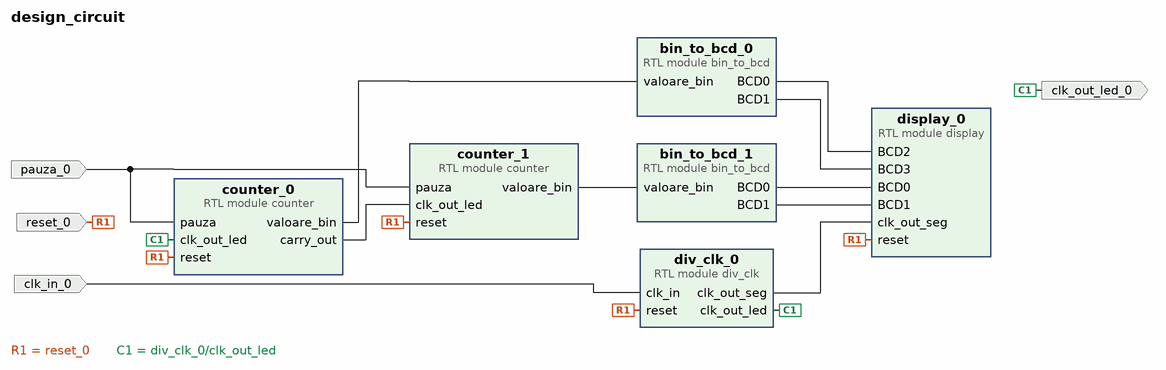
[diagram p0: block diagram of the top level]
# Vivado block design design_circuit, xc7a100tcsg324-1, Vivado 2019.2.1
create_bd_design design_circuit

create_bd_port -dir I pauza_0
create_bd_port -dir I -type rst reset_0
create_bd_port -dir I clk_in_0
create_bd_port -dir O clk_out_led_0

create_bd_cell -type module -reference counter counter_0
create_bd_cell -type module -reference counter counter_1
create_bd_cell -type module -reference bin_to_bcd bin_to_bcd_0
create_bd_cell -type module -reference bin_to_bcd bin_to_bcd_1
create_bd_cell -type module -reference display display_0
create_bd_cell -type module -reference div_clk div_clk_0

# ---- connections ----

connect_bd_net [get_bd_pins counter_0/valoare_bin] [get_bd_pins bin_to_bcd_0/valoare_bin]
connect_bd_net [get_bd_pins counter_0/carry_out] [get_bd_pins counter_1/clk_out_led]
connect_bd_net -net pauza_0_1 [get_bd_ports pauza_0] [get_bd_pins counter_0/pauza] [get_bd_pins counter_1/pauza]
connect_bd_net -net reset_0_1 [get_bd_ports reset_0] \
  [get_bd_pins counter_0/reset] [get_bd_pins display_0/reset] [get_bd_pins counter_1/reset] [get_bd_pins div_clk_0/reset]
connect_bd_net [get_bd_pins counter_1/valoare_bin] [get_bd_pins bin_to_bcd_1/valoare_bin]
connect_bd_net [get_bd_pins bin_to_bcd_0/BCD0] [get_bd_pins display_0/BCD2]
connect_bd_net [get_bd_pins bin_to_bcd_0/BCD1] [get_bd_pins display_0/BCD3]
connect_bd_net [get_bd_pins bin_to_bcd_1/BCD0] [get_bd_pins display_0/BCD0]
connect_bd_net [get_bd_pins bin_to_bcd_1/BCD1] [get_bd_pins display_0/BCD1]
connect_bd_net [get_bd_pins div_clk_0/clk_out_seg] [get_bd_pins display_0/clk_out_seg]
connect_bd_net -net clk_in_0_1 [get_bd_ports clk_in_0] [get_bd_pins div_clk_0/clk_in]
connect_bd_net [get_bd_pins div_clk_0/clk_out_led] [get_bd_pins counter_0/clk_out_led] [get_bd_ports clk_out_led_0]

validate_bd_design
save_bd_design
